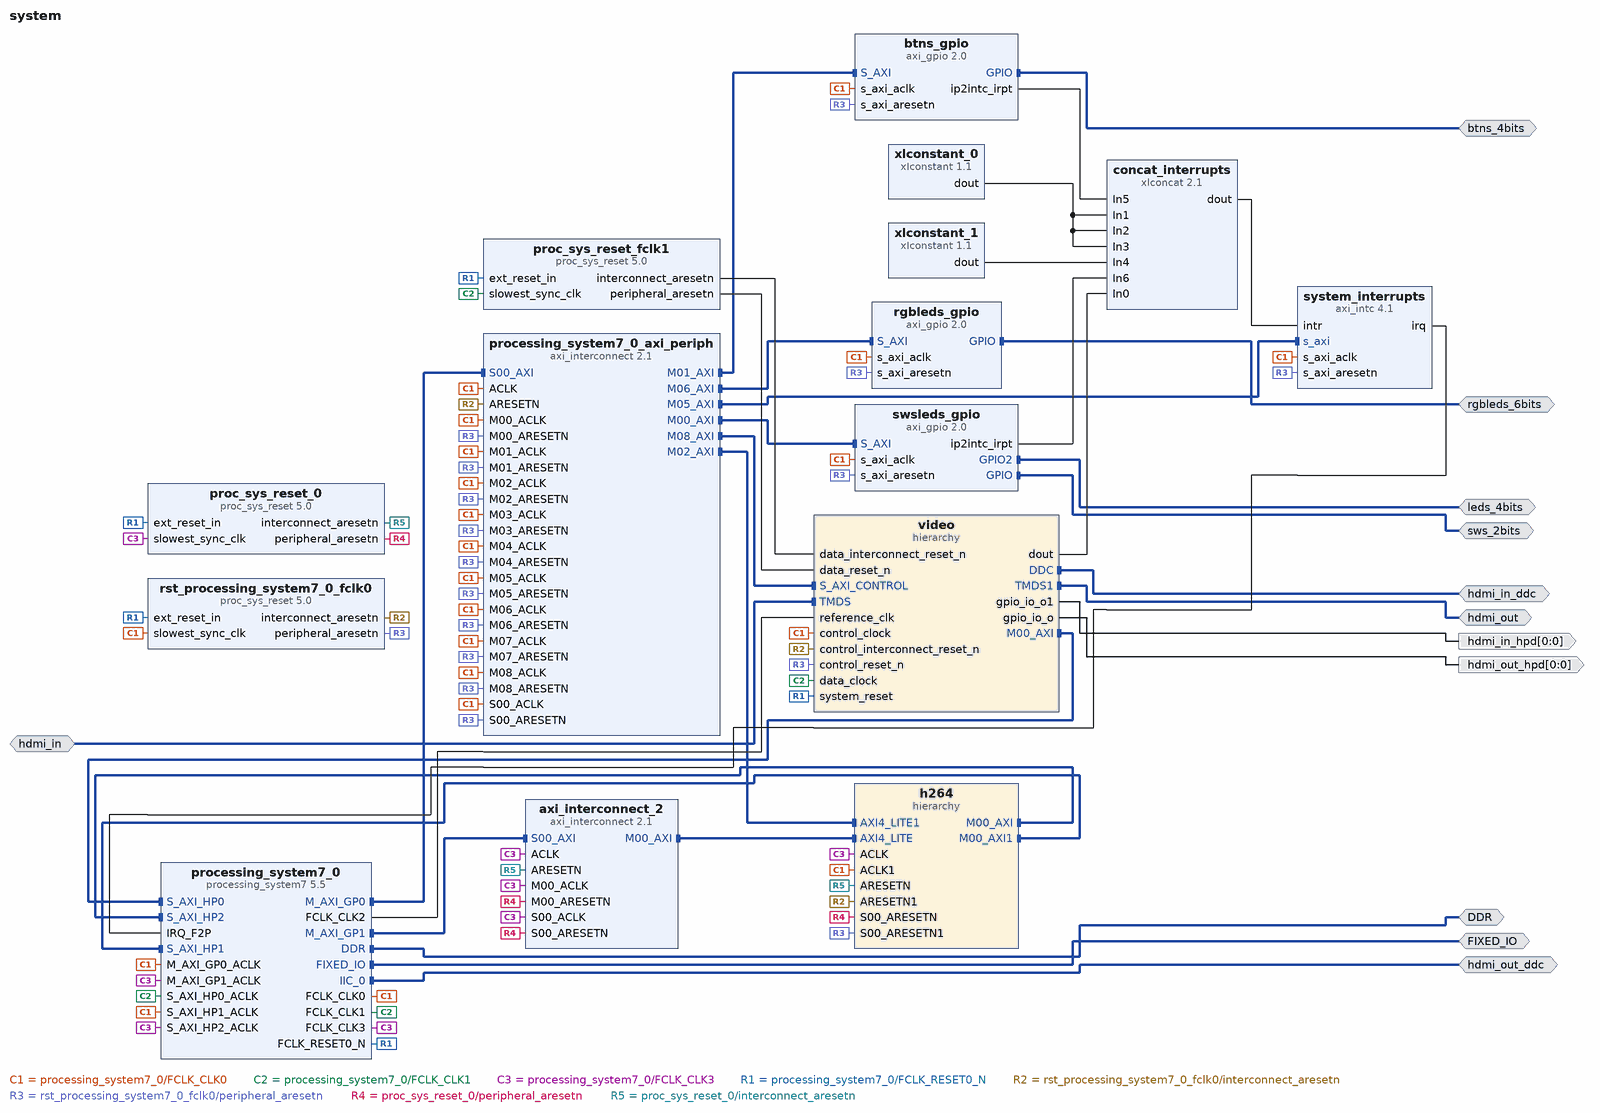
[diagram p0: block diagram of the top level]
# Vivado block design system, Vivado 2016.1
create_bd_design system

create_bd_intf_port -mode Master -vlnv xilinx.com:interface:ddrx_rtl:1.0 DDR
create_bd_intf_port -mode Master -vlnv xilinx.com:display_processing_system7:fixedio_rtl:1.0 FIXED_IO
create_bd_intf_port -mode Master -vlnv xilinx.com:interface:gpio_rtl:1.0 btns_4bits
create_bd_intf_port -mode Slave -vlnv digilentinc.com:interface:tmds_rtl:1.0 hdmi_in
create_bd_intf_port -mode Master -vlnv xilinx.com:interface:iic_rtl:1.0 hdmi_in_ddc
create_bd_intf_port -mode Master -vlnv digilentinc.com:interface:tmds_rtl:1.0 hdmi_out
create_bd_intf_port -mode Master -vlnv xilinx.com:interface:iic_rtl:1.0 hdmi_out_ddc
create_bd_intf_port -mode Master -vlnv xilinx.com:interface:gpio_rtl:1.0 leds_4bits
create_bd_intf_port -mode Master -vlnv xilinx.com:interface:gpio_rtl:1.0 rgbleds_6bits
create_bd_intf_port -mode Master -vlnv xilinx.com:interface:gpio_rtl:1.0 sws_2bits
create_bd_port -dir O -from 0 -to 0 hdmi_in_hpd
create_bd_port -dir O -from 0 -to 0 hdmi_out_hpd

create_bd_cell -type ip -vlnv xilinx.com:ip:axi_gpio:2.0 btns_gpio
set_property -dict {CONFIG.C_GPIO_WIDTH 4 CONFIG.C_ALL_INPUTS 1 CONFIG.C_INTERRUPT_PRESENT 1} [get_bd_cells btns_gpio]
create_bd_cell -type ip -vlnv xilinx.com:ip:xlconcat:2.1 concat_interrupts
set_property -dict {CONFIG.NUM_PORTS 7 CONFIG.IN4_WIDTH 3} [get_bd_cells concat_interrupts]
create_bd_cell -type ip -vlnv xilinx.com:ip:proc_sys_reset:5.0 proc_sys_reset_0
create_bd_cell -type ip -vlnv xilinx.com:ip:proc_sys_reset:5.0 proc_sys_reset_fclk1
create_bd_cell -type ip -vlnv xilinx.com:ip:processing_system7:5.5 processing_system7_0
set_property -dict [list \
  CONFIG.PCW_FCLK_CLK0_BUF true \
  CONFIG.PCW_FCLK_CLK1_BUF true \
  CONFIG.PCW_FCLK_CLK2_BUF true \
  CONFIG.PCW_FCLK_CLK3_BUF true \
  CONFIG.PCW_UIPARAM_DDR_FREQ_MHZ 525 \
  CONFIG.PCW_CRYSTAL_PERIPHERAL_FREQMHZ 50 \
  CONFIG.PCW_APU_PERIPHERAL_FREQMHZ 650 \
  CONFIG.PCW_SDIO_PERIPHERAL_FREQMHZ 50 \
  CONFIG.PCW_UART_PERIPHERAL_FREQMHZ 100 \
  CONFIG.PCW_I2C_PERIPHERAL_FREQMHZ 108.333336 \
  CONFIG.PCW_FPGA0_PERIPHERAL_FREQMHZ 100 \
  CONFIG.PCW_FPGA1_PERIPHERAL_FREQMHZ 142 \
  CONFIG.PCW_FPGA2_PERIPHERAL_FREQMHZ 200 \
  CONFIG.PCW_FPGA3_PERIPHERAL_FREQMHZ 30 \
  CONFIG.PCW_USE_M_AXI_GP1 1 \
  CONFIG.PCW_USE_S_AXI_HP0 1 \
  CONFIG.PCW_USE_S_AXI_HP1 1 \
  CONFIG.PCW_USE_S_AXI_HP2 1 \
  CONFIG.PCW_M_AXI_GP0_FREQMHZ 10 \
  CONFIG.PCW_S_AXI_HP0_FREQMHZ 10 \
  CONFIG.PCW_USE_FABRIC_INTERRUPT 1 \
  CONFIG.PCW_GPIO_EMIO_GPIO_WIDTH 7 \
  CONFIG.PCW_EN_CLK1_PORT 1 \
  CONFIG.PCW_EN_CLK2_PORT 1 \
  CONFIG.PCW_EN_CLK3_PORT 1 \
  CONFIG.PCW_IRQ_F2P_INTR 1 \
  CONFIG.PCW_PERIPHERAL_BOARD_PRESET None \
  CONFIG.PCW_PRESET_BANK1_VOLTAGE {LVCMOS 1.8V} \
  CONFIG.PCW_UIPARAM_DDR_BUS_WIDTH {16 Bit} \
  CONFIG.PCW_UIPARAM_DDR_PARTNO Custom \
  CONFIG.PCW_QSPI_PERIPHERAL_ENABLE 1 \
  CONFIG.PCW_QSPI_QSPI_IO {MIO 1 .. 6} \
  CONFIG.PCW_QSPI_GRP_SINGLE_SS_ENABLE 1 \
  CONFIG.PCW_QSPI_GRP_SINGLE_SS_IO {MIO 1 .. 6} \
  CONFIG.PCW_QSPI_GRP_FBCLK_ENABLE 1 \
  CONFIG.PCW_QSPI_GRP_FBCLK_IO {MIO 8} \
  CONFIG.PCW_ENET0_PERIPHERAL_ENABLE 1 \
  CONFIG.PCW_ENET0_ENET0_IO {MIO 16 .. 27} \
  CONFIG.PCW_ENET0_GRP_MDIO_ENABLE 1 \
  CONFIG.PCW_ENET0_GRP_MDIO_IO {MIO 52 .. 53} \
  CONFIG.PCW_SD0_PERIPHERAL_ENABLE 1 \
  CONFIG.PCW_SD0_SD0_IO {MIO 40 .. 45} \
  CONFIG.PCW_SD0_GRP_CD_ENABLE 1 \
  CONFIG.PCW_SD0_GRP_CD_IO {MIO 47} \
  CONFIG.PCW_SD0_GRP_WP_ENABLE 0 \
  CONFIG.PCW_UART0_PERIPHERAL_ENABLE 1 \
  CONFIG.PCW_UART0_UART0_IO {MIO 14 .. 15} \
  CONFIG.PCW_UART1_PERIPHERAL_ENABLE 0 \
  CONFIG.PCW_USB0_PERIPHERAL_ENABLE 1 \
  CONFIG.PCW_USB0_USB0_IO {MIO 28 .. 39} \
  CONFIG.PCW_I2C0_PERIPHERAL_ENABLE 1 \
  CONFIG.PCW_I2C0_I2C0_IO EMIO \
  CONFIG.PCW_GPIO_MIO_GPIO_ENABLE 0 \
  CONFIG.PCW_GPIO_EMIO_GPIO_ENABLE 1 \
  CONFIG.PCW_GPIO_EMIO_GPIO_IO 7 \
  CONFIG.PCW_FPGA_FCLK1_ENABLE 1 \
  CONFIG.PCW_FPGA_FCLK2_ENABLE 1 \
  CONFIG.PCW_FPGA_FCLK3_ENABLE 1 \
] [get_bd_cells processing_system7_0]
# 481 more settings of processing_system7_0 are not shown: defaults, MIO pin electricals, DDR timing, and values the tool derives
create_bd_cell -type ip -vlnv xilinx.com:ip:axi_interconnect:2.1 processing_system7_0_axi_periph
set_property -dict {CONFIG.NUM_MI 9} [get_bd_cells processing_system7_0_axi_periph]
create_bd_cell -type ip -vlnv xilinx.com:ip:axi_gpio:2.0 rgbleds_gpio
set_property -dict {CONFIG.C_GPIO_WIDTH 6 CONFIG.C_ALL_OUTPUTS 1} [get_bd_cells rgbleds_gpio]
create_bd_cell -type ip -vlnv xilinx.com:ip:proc_sys_reset:5.0 rst_processing_system7_0_fclk0
create_bd_cell -type ip -vlnv xilinx.com:ip:axi_gpio:2.0 swsleds_gpio
set_property -dict [list \
  CONFIG.C_GPIO_WIDTH 2 \
  CONFIG.C_GPIO2_WIDTH 4 \
  CONFIG.C_IS_DUAL 1 \
  CONFIG.C_ALL_INPUTS 1 \
  CONFIG.C_INTERRUPT_PRESENT 1 \
  CONFIG.C_ALL_OUTPUTS_2 1 \
] [get_bd_cells swsleds_gpio]
create_bd_cell -type ip -vlnv xilinx.com:ip:axi_intc:4.1 system_interrupts
create_bd_cell -type hier video
create_bd_cell -type ip -vlnv xilinx.com:ip:xlconstant:1.1 xlconstant_0
set_property -dict {CONFIG.CONST_VAL 0} [get_bd_cells xlconstant_0]
create_bd_cell -type ip -vlnv xilinx.com:ip:xlconstant:1.1 xlconstant_1
set_property -dict {CONFIG.CONST_WIDTH 3 CONFIG.CONST_VAL 0} [get_bd_cells xlconstant_1]
create_bd_cell -type ip -vlnv xilinx.com:ip:axi_interconnect:2.1 axi_interconnect_2
set_property -dict {CONFIG.NUM_MI 1} [get_bd_cells axi_interconnect_2]
create_bd_cell -type hier h264

# ---- hierarchy /video ----
current_bd_instance /video
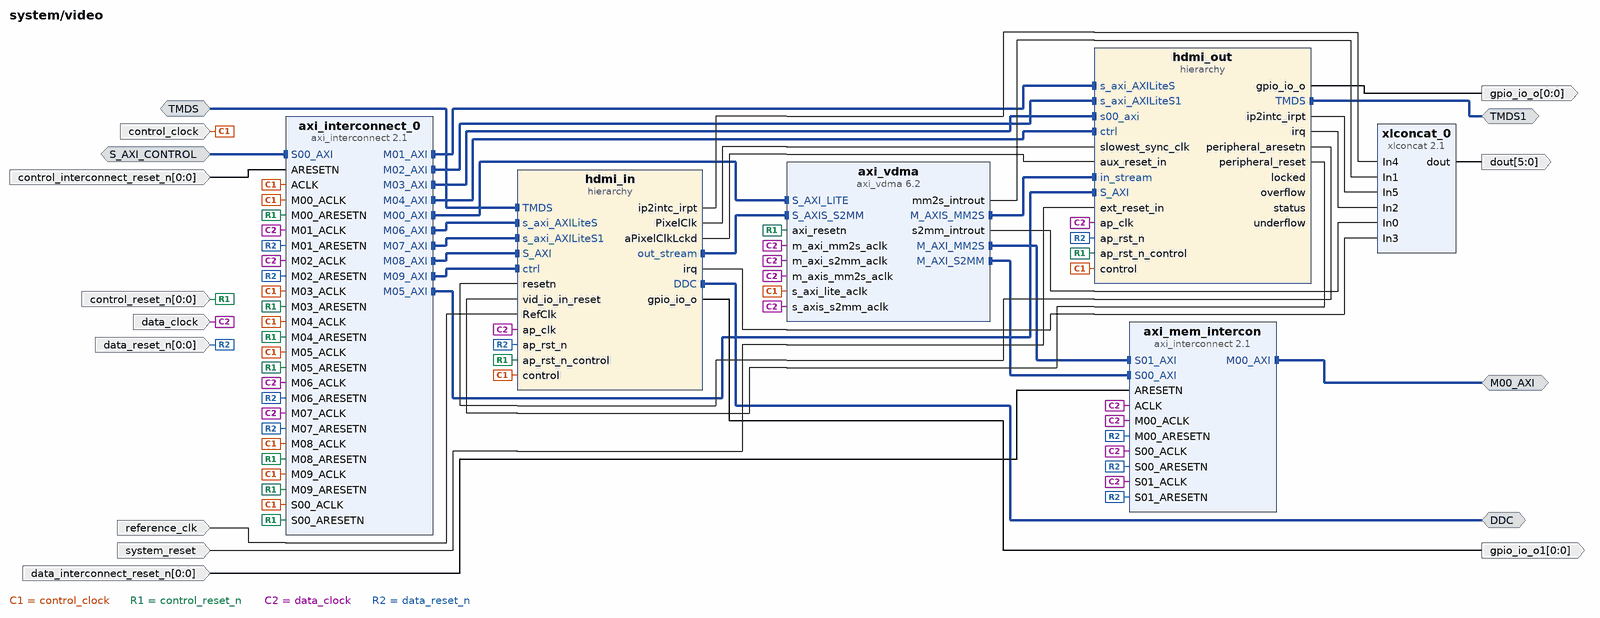
[diagram p1: block diagram inside /video]
create_bd_intf_pin -mode Master -vlnv xilinx.com:interface:iic_rtl:1.0 DDC
create_bd_intf_pin -mode Master -vlnv xilinx.com:interface:aximm_rtl:1.0 M00_AXI
create_bd_intf_pin -mode Slave -vlnv xilinx.com:interface:aximm_rtl:1.0 S_AXI_CONTROL
create_bd_intf_pin -mode Slave -vlnv digilentinc.com:interface:tmds_rtl:1.0 TMDS
create_bd_intf_pin -mode Master -vlnv digilentinc.com:interface:tmds_rtl:1.0 TMDS1
create_bd_pin -dir I -type clk control_clock
create_bd_pin -dir I -from 0 -to 0 -type rst control_interconnect_reset_n
create_bd_pin -dir I -from 0 -to 0 -type rst control_reset_n
create_bd_pin -dir I data_clock
create_bd_pin -dir I -from 0 -to 0 -type rst data_interconnect_reset_n
create_bd_pin -dir I -from 0 -to 0 -type rst data_reset_n
create_bd_pin -dir O -from 5 -to 0 dout
create_bd_pin -dir O -from 0 -to 0 gpio_io_o
create_bd_pin -dir O -from 0 -to 0 gpio_io_o1
create_bd_pin -dir I -type clk reference_clk
create_bd_pin -dir I -type rst system_reset

create_bd_cell -type ip -vlnv xilinx.com:ip:axi_interconnect:2.1 axi_interconnect_0
set_property -dict {CONFIG.NUM_MI 10} [get_bd_cells axi_interconnect_0]
create_bd_cell -type ip -vlnv xilinx.com:ip:axi_interconnect:2.1 axi_mem_intercon
set_property -dict {CONFIG.NUM_SI 2 CONFIG.NUM_MI 1} [get_bd_cells axi_mem_intercon]
create_bd_cell -type ip -vlnv xilinx.com:ip:axi_vdma:6.2 axi_vdma
set_property -dict [list \
  CONFIG.c_m_axi_mm2s_data_width 32 \
  CONFIG.c_m_axis_mm2s_tdata_width 32 \
  CONFIG.c_num_fstores 4 \
  CONFIG.c_mm2s_genlock_mode 1 \
  CONFIG.c_s2mm_genlock_mode 0 \
  CONFIG.c_mm2s_linebuffer_depth 512 \
  CONFIG.c_s2mm_linebuffer_depth 4096 \
  CONFIG.c_mm2s_max_burst_length 32 \
  CONFIG.c_s2mm_max_burst_length 32 \
] [get_bd_cells axi_vdma]
create_bd_cell -type hier hdmi_in
create_bd_cell -type hier hdmi_out
create_bd_cell -type ip -vlnv xilinx.com:ip:xlconcat:2.1 xlconcat_0
set_property -dict {CONFIG.NUM_PORTS 6} [get_bd_cells xlconcat_0]

# ---- hierarchy /video/hdmi_in ----
current_bd_instance /video/hdmi_in
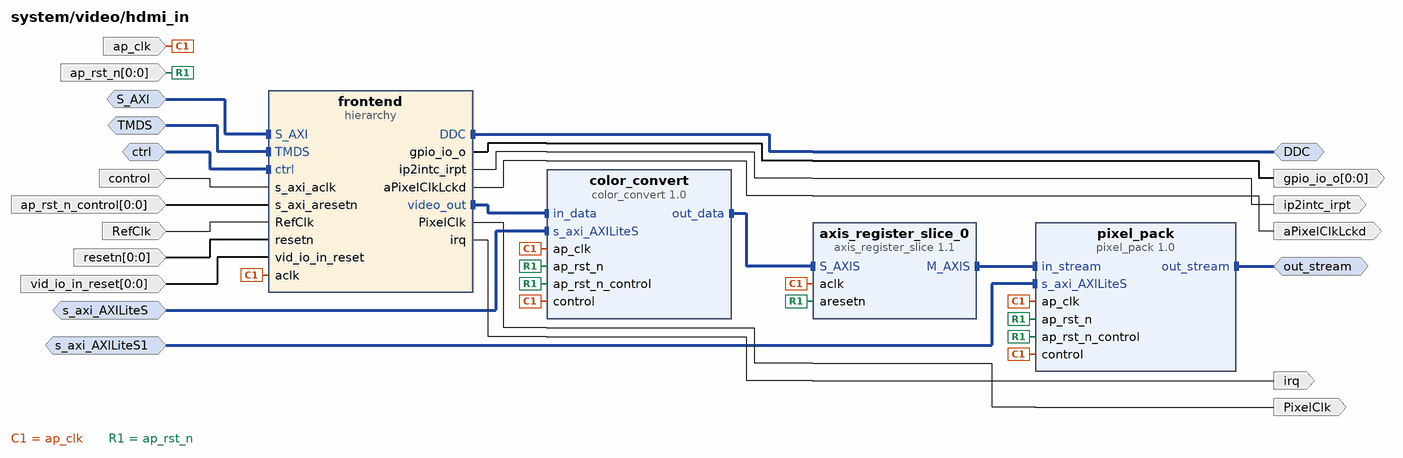
[diagram p2: block diagram inside /video/hdmi_in]
create_bd_intf_pin -mode Master -vlnv xilinx.com:interface:iic_rtl:1.0 DDC
create_bd_intf_pin -mode Slave -vlnv xilinx.com:interface:aximm_rtl:1.0 S_AXI
create_bd_intf_pin -mode Slave -vlnv digilentinc.com:interface:tmds_rtl:1.0 TMDS
create_bd_intf_pin -mode Slave -vlnv xilinx.com:interface:aximm_rtl:1.0 ctrl
create_bd_intf_pin -mode Master -vlnv xilinx.com:interface:axis_rtl:1.0 out_stream
create_bd_intf_pin -mode Slave -vlnv xilinx.com:interface:aximm_rtl:1.0 s_axi_AXILiteS
create_bd_intf_pin -mode Slave -vlnv xilinx.com:interface:aximm_rtl:1.0 s_axi_AXILiteS1
create_bd_pin -dir O -type clk PixelClk
create_bd_pin -dir I -type clk RefClk
create_bd_pin -dir O aPixelClkLckd
create_bd_pin -dir I -type clk ap_clk
create_bd_pin -dir I -from 0 -to 0 -type rst ap_rst_n
create_bd_pin -dir I -from 0 -to 0 -type rst ap_rst_n_control
create_bd_pin -dir I -type clk control
create_bd_pin -dir O -from 0 -to 0 gpio_io_o
create_bd_pin -dir O -type intr ip2intc_irpt
create_bd_pin -dir O -type intr irq
create_bd_pin -dir I -from 0 -to 0 -type rst resetn
create_bd_pin -dir I -from 0 -to 0 -type rst vid_io_in_reset

create_bd_cell -type ip -vlnv xilinx.com:ip:axis_register_slice:1.1 axis_register_slice_0
create_bd_cell -type ip -vlnv xilinx.com:hls:color_convert:1.0 color_convert
create_bd_cell -type hier frontend
create_bd_cell -type ip -vlnv xilinx.com:hls:pixel_pack:1.0 pixel_pack

# ---- hierarchy /video/hdmi_in/frontend ----
current_bd_instance /video/hdmi_in/frontend
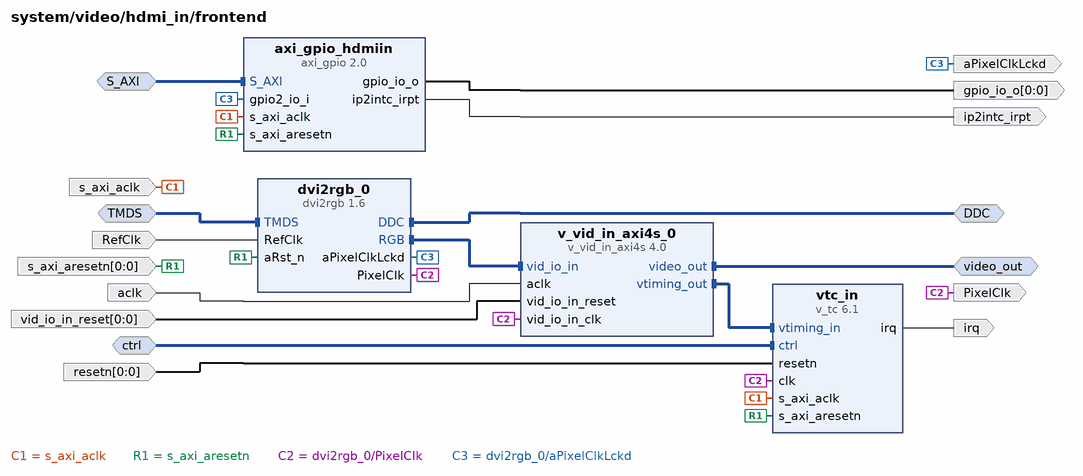
[diagram p3: block diagram inside /video/hdmi_in/frontend]
create_bd_intf_pin -mode Master -vlnv xilinx.com:interface:iic_rtl:1.0 DDC
create_bd_intf_pin -mode Slave -vlnv xilinx.com:interface:aximm_rtl:1.0 S_AXI
create_bd_intf_pin -mode Slave -vlnv digilentinc.com:interface:tmds_rtl:1.0 TMDS
create_bd_intf_pin -mode Slave -vlnv xilinx.com:interface:aximm_rtl:1.0 ctrl
create_bd_intf_pin -mode Master -vlnv xilinx.com:interface:axis_rtl:1.0 video_out
create_bd_pin -dir O -type clk PixelClk
create_bd_pin -dir I -type clk RefClk
create_bd_pin -dir O aPixelClkLckd
create_bd_pin -dir I -type clk aclk
create_bd_pin -dir O -from 0 -to 0 gpio_io_o
create_bd_pin -dir O -type intr ip2intc_irpt
create_bd_pin -dir O -type intr irq
create_bd_pin -dir I -from 0 -to 0 -type rst resetn
create_bd_pin -dir I -type clk s_axi_aclk
create_bd_pin -dir I -from 0 -to 0 -type rst s_axi_aresetn
create_bd_pin -dir I -from 0 -to 0 -type rst vid_io_in_reset

create_bd_cell -type ip -vlnv xilinx.com:ip:axi_gpio:2.0 axi_gpio_hdmiin
set_property -dict [list \
  CONFIG.C_GPIO_WIDTH 1 \
  CONFIG.C_GPIO2_WIDTH 1 \
  CONFIG.C_IS_DUAL 1 \
  CONFIG.C_ALL_INPUTS_2 1 \
  CONFIG.C_INTERRUPT_PRESENT 1 \
  CONFIG.C_ALL_OUTPUTS 1 \
] [get_bd_cells axi_gpio_hdmiin]
create_bd_cell -type ip -vlnv digilentinc.com:ip:dvi2rgb:1.6 dvi2rgb_0
set_property -dict [list \
  CONFIG.kRstActiveHigh false \
  CONFIG.kClkRange 1 \
  CONFIG.kAddBUFG false \
  CONFIG.kEdidFileName 720p_edid.txt \
] [get_bd_cells dvi2rgb_0]
create_bd_cell -type ip -vlnv xilinx.com:ip:v_vid_in_axi4s:4.0 v_vid_in_axi4s_0
set_property -dict {CONFIG.C_HAS_ASYNC_CLK 1 CONFIG.C_ADDR_WIDTH 12} [get_bd_cells v_vid_in_axi4s_0]
create_bd_cell -type ip -vlnv xilinx.com:ip:v_tc:6.1 vtc_in
set_property -dict [list \
  CONFIG.HAS_INTC_IF true \
  CONFIG.max_lines_per_frame 2048 \
  CONFIG.horizontal_blank_detection false \
  CONFIG.enable_generation false \
  CONFIG.vertical_blank_detection false \
] [get_bd_cells vtc_in]

# ---- hierarchy /video/hdmi_out ----
current_bd_instance /video/hdmi_out
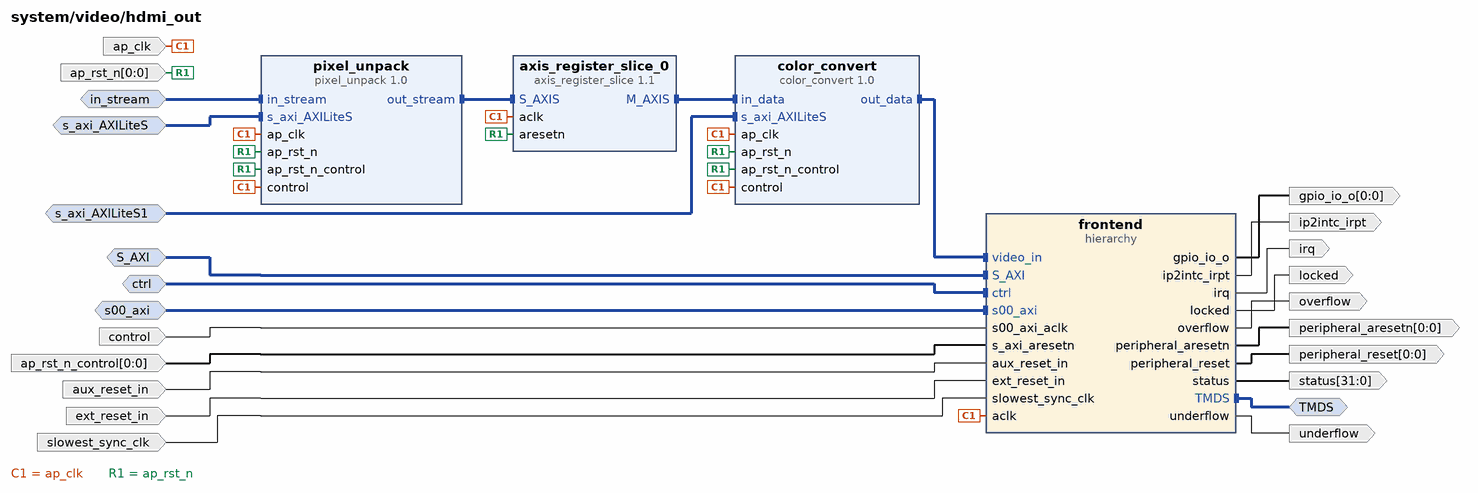
[diagram p4: block diagram inside /video/hdmi_out]
create_bd_intf_pin -mode Slave -vlnv xilinx.com:interface:aximm_rtl:1.0 S_AXI
create_bd_intf_pin -mode Master -vlnv digilentinc.com:interface:tmds_rtl:1.0 TMDS
create_bd_intf_pin -mode Slave -vlnv xilinx.com:interface:aximm_rtl:1.0 ctrl
create_bd_intf_pin -mode Slave -vlnv xilinx.com:interface:axis_rtl:1.0 in_stream
create_bd_intf_pin -mode Slave -vlnv xilinx.com:interface:aximm_rtl:1.0 s00_axi
create_bd_intf_pin -mode Slave -vlnv xilinx.com:interface:aximm_rtl:1.0 s_axi_AXILiteS
create_bd_intf_pin -mode Slave -vlnv xilinx.com:interface:aximm_rtl:1.0 s_axi_AXILiteS1
create_bd_pin -dir I -type clk ap_clk
create_bd_pin -dir I -from 0 -to 0 -type rst ap_rst_n
create_bd_pin -dir I -from 0 -to 0 -type rst ap_rst_n_control
create_bd_pin -dir I -type rst aux_reset_in
create_bd_pin -dir I -type clk control
create_bd_pin -dir I -type rst ext_reset_in
create_bd_pin -dir O -from 0 -to 0 gpio_io_o
create_bd_pin -dir O -type intr ip2intc_irpt
create_bd_pin -dir O -type intr irq
create_bd_pin -dir O locked
create_bd_pin -dir O overflow
create_bd_pin -dir O -from 0 -to 0 -type rst peripheral_aresetn
create_bd_pin -dir O -from 0 -to 0 -type rst peripheral_reset
create_bd_pin -dir I -type clk slowest_sync_clk
create_bd_pin -dir O -from 31 -to 0 status
create_bd_pin -dir O underflow

create_bd_cell -type ip -vlnv xilinx.com:ip:axis_register_slice:1.1 axis_register_slice_0
create_bd_cell -type ip -vlnv xilinx.com:hls:color_convert:1.0 color_convert
create_bd_cell -type hier frontend
create_bd_cell -type ip -vlnv xilinx.com:hls:pixel_unpack:1.0 pixel_unpack

# ---- hierarchy /video/hdmi_out/frontend ----
current_bd_instance /video/hdmi_out/frontend
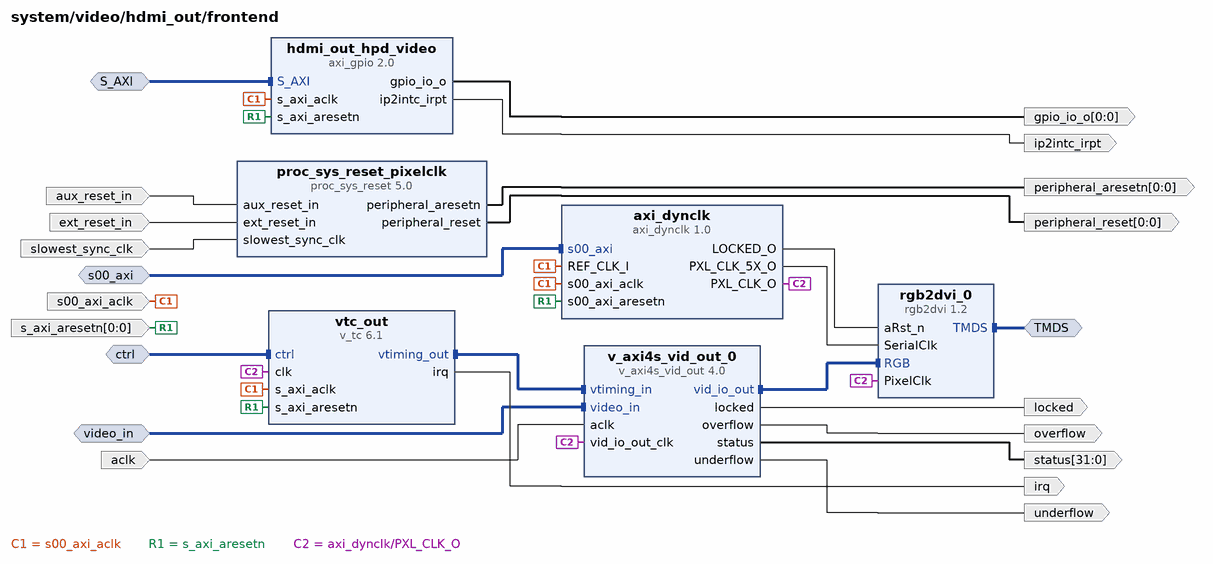
[diagram p5: block diagram inside /video/hdmi_out/frontend]
create_bd_intf_pin -mode Slave -vlnv xilinx.com:interface:aximm_rtl:1.0 S_AXI
create_bd_intf_pin -mode Master -vlnv digilentinc.com:interface:tmds_rtl:1.0 TMDS
create_bd_intf_pin -mode Slave -vlnv xilinx.com:interface:aximm_rtl:1.0 ctrl
create_bd_intf_pin -mode Slave -vlnv xilinx.com:interface:aximm_rtl:1.0 s00_axi
create_bd_intf_pin -mode Slave -vlnv xilinx.com:interface:axis_rtl:1.0 video_in
create_bd_pin -dir I -type clk aclk
create_bd_pin -dir I -type rst aux_reset_in
create_bd_pin -dir I -type rst ext_reset_in
create_bd_pin -dir O -from 0 -to 0 gpio_io_o
create_bd_pin -dir O -type intr ip2intc_irpt
create_bd_pin -dir O -type intr irq
create_bd_pin -dir O locked
create_bd_pin -dir O overflow
create_bd_pin -dir O -from 0 -to 0 -type rst peripheral_aresetn
create_bd_pin -dir O -from 0 -to 0 -type rst peripheral_reset
create_bd_pin -dir I -type clk s00_axi_aclk
create_bd_pin -dir I -from 0 -to 0 -type rst s_axi_aresetn
create_bd_pin -dir I -type clk slowest_sync_clk
create_bd_pin -dir O -from 31 -to 0 status
create_bd_pin -dir O underflow

create_bd_cell -type ip -vlnv digilentinc.com:ip:axi_dynclk:1.0 axi_dynclk
create_bd_cell -type ip -vlnv xilinx.com:ip:axi_gpio:2.0 hdmi_out_hpd_video
set_property -dict {CONFIG.C_GPIO_WIDTH 1 CONFIG.C_INTERRUPT_PRESENT 1 CONFIG.C_ALL_OUTPUTS 1} [get_bd_cells hdmi_out_hpd_video]
create_bd_cell -type ip -vlnv xilinx.com:ip:proc_sys_reset:5.0 proc_sys_reset_pixelclk
create_bd_cell -type ip -vlnv digilentinc.com:ip:rgb2dvi:1.2 rgb2dvi_0
set_property -dict {CONFIG.kRstActiveHigh false CONFIG.kGenerateSerialClk false CONFIG.kClkRange 2} [get_bd_cells rgb2dvi_0]
create_bd_cell -type ip -vlnv xilinx.com:ip:v_axi4s_vid_out:4.0 v_axi4s_vid_out_0
set_property -dict [list \
  CONFIG.C_HAS_ASYNC_CLK 1 \
  CONFIG.C_ADDR_WIDTH 11 \
  CONFIG.C_HYSTERESIS_LEVEL 1024 \
  CONFIG.C_VTG_MASTER_SLAVE 1 \
] [get_bd_cells v_axi4s_vid_out_0]
create_bd_cell -type ip -vlnv xilinx.com:ip:v_tc:6.1 vtc_out
set_property -dict {CONFIG.enable_detection false} [get_bd_cells vtc_out]

# ---- hierarchy /h264 ----
current_bd_instance /h264
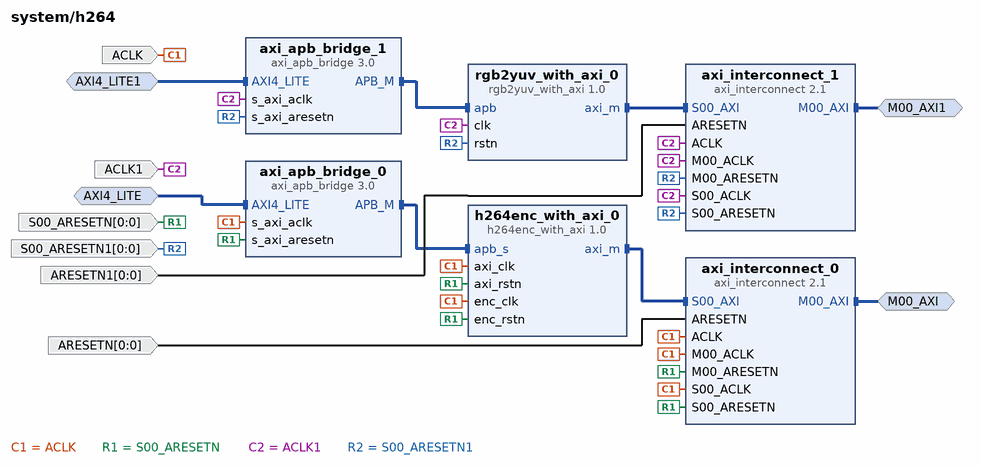
[diagram p6: block diagram inside /h264]
create_bd_intf_pin -mode Slave -vlnv xilinx.com:interface:aximm_rtl:1.0 AXI4_LITE
create_bd_intf_pin -mode Slave -vlnv xilinx.com:interface:aximm_rtl:1.0 AXI4_LITE1
create_bd_intf_pin -mode Master -vlnv xilinx.com:interface:aximm_rtl:1.0 M00_AXI
create_bd_intf_pin -mode Master -vlnv xilinx.com:interface:aximm_rtl:1.0 M00_AXI1
create_bd_pin -dir I -type clk ACLK
create_bd_pin -dir I -from 0 -to 0 -type rst S00_ARESETN
create_bd_pin -dir I -type clk ACLK1
create_bd_pin -dir I -from 0 -to 0 -type rst S00_ARESETN1
create_bd_pin -dir I -from 0 -to 0 -type rst ARESETN
create_bd_pin -dir I -from 0 -to 0 -type rst ARESETN1

create_bd_cell -type ip -vlnv xilinx.com:user:h264enc_with_axi:1.0 h264enc_with_axi_0
create_bd_cell -type ip -vlnv xilinx.com:user:rgb2yuv_with_axi:1.0 rgb2yuv_with_axi_0
create_bd_cell -type ip -vlnv xilinx.com:ip:axi_apb_bridge:3.0 axi_apb_bridge_0
set_property -dict {CONFIG.C_APB_NUM_SLAVES 1} [get_bd_cells axi_apb_bridge_0]
create_bd_cell -type ip -vlnv xilinx.com:ip:axi_apb_bridge:3.0 axi_apb_bridge_1
set_property -dict {CONFIG.C_APB_NUM_SLAVES 1} [get_bd_cells axi_apb_bridge_1]
create_bd_cell -type ip -vlnv xilinx.com:ip:axi_interconnect:2.1 axi_interconnect_0
set_property -dict {CONFIG.NUM_MI 1} [get_bd_cells axi_interconnect_0]
create_bd_cell -type ip -vlnv xilinx.com:ip:axi_interconnect:2.1 axi_interconnect_1
set_property -dict {CONFIG.NUM_MI 1} [get_bd_cells axi_interconnect_1]

# ---- connections ----

current_bd_instance /video
connect_bd_intf_net [get_bd_intf_pins axi_interconnect_0/M00_AXI] [get_bd_intf_pins axi_vdma/S_AXI_LITE]
connect_bd_intf_net [get_bd_intf_pins axi_interconnect_0/M01_AXI] [get_bd_intf_pins hdmi_out/s_axi_AXILiteS]
connect_bd_intf_net [get_bd_intf_pins axi_interconnect_0/M02_AXI] [get_bd_intf_pins hdmi_out/s_axi_AXILiteS1]
connect_bd_intf_net [get_bd_intf_pins axi_interconnect_0/M03_AXI] [get_bd_intf_pins hdmi_out/s00_axi]
connect_bd_intf_net [get_bd_intf_pins axi_interconnect_0/M04_AXI] [get_bd_intf_pins hdmi_out/ctrl]
connect_bd_intf_net [get_bd_intf_pins axi_interconnect_0/M05_AXI] [get_bd_intf_pins hdmi_out/S_AXI]
connect_bd_intf_net [get_bd_intf_pins axi_interconnect_0/M06_AXI] [get_bd_intf_pins hdmi_in/s_axi_AXILiteS]
connect_bd_intf_net [get_bd_intf_pins axi_interconnect_0/M07_AXI] [get_bd_intf_pins hdmi_in/s_axi_AXILiteS1]
connect_bd_intf_net [get_bd_intf_pins axi_interconnect_0/M08_AXI] [get_bd_intf_pins hdmi_in/S_AXI]
connect_bd_intf_net [get_bd_intf_pins axi_interconnect_0/M09_AXI] [get_bd_intf_pins hdmi_in/ctrl]
connect_bd_intf_net -intf_net axi_vdma_0_M_AXIS_MM2S [get_bd_intf_pins axi_vdma/M_AXIS_MM2S] [get_bd_intf_pins hdmi_out/in_stream]
connect_bd_intf_net -intf_net axi_vdma_0_M_AXI_MM2S [get_bd_intf_pins axi_mem_intercon/S01_AXI] [get_bd_intf_pins axi_vdma/M_AXI_MM2S]
connect_bd_intf_net -intf_net axi_vdma_0_M_AXI_S2MM [get_bd_intf_pins axi_mem_intercon/S00_AXI] [get_bd_intf_pins axi_vdma/M_AXI_S2MM]
connect_bd_intf_net -intf_net in_pixelformat_M00_AXIS [get_bd_intf_pins axi_vdma/S_AXIS_S2MM] [get_bd_intf_pins hdmi_in/out_stream]
connect_bd_intf_net -intf_net frontend_DDC [get_bd_intf_pins DDC] [get_bd_intf_pins hdmi_in/DDC]
connect_bd_intf_net [get_bd_intf_pins M00_AXI] [get_bd_intf_pins axi_mem_intercon/M00_AXI]
connect_bd_intf_net [get_bd_intf_pins S_AXI_CONTROL] [get_bd_intf_pins axi_interconnect_0/S00_AXI]
connect_bd_intf_net [get_bd_intf_pins TMDS] [get_bd_intf_pins hdmi_in/TMDS]
connect_bd_intf_net [get_bd_intf_pins TMDS1] [get_bd_intf_pins hdmi_out/TMDS]
connect_bd_net -net ARESETN_1 [get_bd_pins control_interconnect_reset_n] [get_bd_pins axi_interconnect_0/ARESETN]
connect_bd_net [get_bd_pins control_clock] \
  [get_bd_pins axi_vdma/s_axi_lite_aclk] [get_bd_pins axi_interconnect_0/ACLK] [get_bd_pins axi_interconnect_0/M00_ACLK] \
  [get_bd_pins axi_interconnect_0/M03_ACLK] [get_bd_pins axi_interconnect_0/M04_ACLK] \
  [get_bd_pins axi_interconnect_0/M05_ACLK] [get_bd_pins axi_interconnect_0/M08_ACLK] \
  [get_bd_pins axi_interconnect_0/M09_ACLK] [get_bd_pins axi_interconnect_0/S00_ACLK] [get_bd_pins hdmi_in/control] \
  [get_bd_pins hdmi_out/control]
connect_bd_net [get_bd_pins control_reset_n] \
  [get_bd_pins axi_vdma/axi_resetn] [get_bd_pins axi_interconnect_0/M00_ARESETN] [get_bd_pins axi_interconnect_0/M03_ARESETN] \
  [get_bd_pins axi_interconnect_0/M04_ARESETN] [get_bd_pins axi_interconnect_0/M05_ARESETN] \
  [get_bd_pins axi_interconnect_0/M08_ARESETN] [get_bd_pins axi_interconnect_0/M09_ARESETN] \
  [get_bd_pins axi_interconnect_0/S00_ARESETN] [get_bd_pins hdmi_in/ap_rst_n_control] [get_bd_pins hdmi_out/ap_rst_n_control]
connect_bd_net -net RefClk_1 [get_bd_pins reference_clk] [get_bd_pins hdmi_in/RefClk]
connect_bd_net -net aclk_1 [get_bd_pins data_clock] \
  [get_bd_pins axi_vdma/m_axi_mm2s_aclk] [get_bd_pins axi_vdma/m_axi_s2mm_aclk] [get_bd_pins axi_vdma/m_axis_mm2s_aclk] \
  [get_bd_pins axi_vdma/s_axis_s2mm_aclk] [get_bd_pins axi_interconnect_0/M01_ACLK] [get_bd_pins axi_interconnect_0/M02_ACLK] \
  [get_bd_pins axi_interconnect_0/M06_ACLK] [get_bd_pins axi_interconnect_0/M07_ACLK] [get_bd_pins axi_mem_intercon/ACLK] \
  [get_bd_pins axi_mem_intercon/M00_ACLK] [get_bd_pins axi_mem_intercon/S00_ACLK] [get_bd_pins axi_mem_intercon/S01_ACLK] \
  [get_bd_pins hdmi_in/ap_clk] [get_bd_pins hdmi_out/ap_clk]
connect_bd_net -net axi_gpio_video_gpio_io_o [get_bd_pins hdmi_in/gpio_io_o] [get_bd_pins gpio_io_o1]
connect_bd_net -net axi_gpio_video_ip2intc_irpt [get_bd_pins hdmi_in/ip2intc_irpt] [get_bd_pins xlconcat_0/In4]
connect_bd_net -net axi_vdma_0_mm2s_introut [get_bd_pins axi_vdma/mm2s_introut] [get_bd_pins xlconcat_0/In1]
connect_bd_net -net axi_vdma_0_s2mm_introut [get_bd_pins axi_vdma/s2mm_introut] [get_bd_pins xlconcat_0/In0]
connect_bd_net -net ext_reset_in_1 [get_bd_pins system_reset] [get_bd_pins hdmi_out/ext_reset_in]
connect_bd_net [get_bd_pins hdmi_in/PixelClk] [get_bd_pins hdmi_out/slowest_sync_clk]
connect_bd_net [get_bd_pins hdmi_in/aPixelClkLckd] [get_bd_pins hdmi_out/aux_reset_in]
connect_bd_net -net hdmi_out_hpd_video_gpio_io_o [get_bd_pins hdmi_out/gpio_io_o] [get_bd_pins gpio_io_o]
connect_bd_net -net hdmi_out_hpd_video_ip2intc_irpt [get_bd_pins hdmi_out/ip2intc_irpt] [get_bd_pins xlconcat_0/In5]
# net locked has one end: hdmi_out/locked
# net overflow has one end: hdmi_out/overflow
connect_bd_net -net resetn_1 [get_bd_pins hdmi_out/peripheral_aresetn] [get_bd_pins hdmi_in/resetn]
connect_bd_net -net rst_processing_system7_0_100M_interconnect_aresetn [get_bd_pins data_interconnect_reset_n] [get_bd_pins axi_mem_intercon/ARESETN]
connect_bd_net -net rst_processing_system7_0_100M_peripheral_aresetn [get_bd_pins data_reset_n] \
  [get_bd_pins axi_interconnect_0/M01_ARESETN] [get_bd_pins axi_interconnect_0/M02_ARESETN] \
  [get_bd_pins axi_interconnect_0/M06_ARESETN] [get_bd_pins axi_interconnect_0/M07_ARESETN] \
  [get_bd_pins axi_mem_intercon/M00_ARESETN] [get_bd_pins axi_mem_intercon/S00_ARESETN] \
  [get_bd_pins axi_mem_intercon/S01_ARESETN] [get_bd_pins hdmi_in/ap_rst_n] [get_bd_pins hdmi_out/ap_rst_n]
# net status has one end: hdmi_out/status
# net underflow has one end: hdmi_out/underflow
connect_bd_net -net v_tc_0_irq [get_bd_pins hdmi_out/irq] [get_bd_pins xlconcat_0/In2]
connect_bd_net -net v_tc_1_irq [get_bd_pins hdmi_in/irq] [get_bd_pins xlconcat_0/In3]
connect_bd_net -net vid_io_in_reset_1 [get_bd_pins hdmi_out/peripheral_reset] [get_bd_pins hdmi_in/vid_io_in_reset]
connect_bd_net [get_bd_pins xlconcat_0/dout] [get_bd_pins dout]

current_bd_instance /video/hdmi_in
connect_bd_intf_net [get_bd_intf_pins axis_register_slice_0/M_AXIS] [get_bd_intf_pins pixel_pack/in_stream]
connect_bd_intf_net [get_bd_intf_pins axis_register_slice_0/S_AXIS] [get_bd_intf_pins color_convert/out_data]
connect_bd_intf_net -intf_net hdmi_in_video_out [get_bd_intf_pins color_convert/in_data] [get_bd_intf_pins frontend/video_out]
connect_bd_intf_net [get_bd_intf_pins DDC] [get_bd_intf_pins frontend/DDC]
connect_bd_intf_net [get_bd_intf_pins S_AXI] [get_bd_intf_pins frontend/S_AXI]
connect_bd_intf_net [get_bd_intf_pins TMDS] [get_bd_intf_pins frontend/TMDS]
connect_bd_intf_net [get_bd_intf_pins ctrl] [get_bd_intf_pins frontend/ctrl]
connect_bd_intf_net -intf_net in_pixelformat_M00_AXIS [get_bd_intf_pins out_stream] [get_bd_intf_pins pixel_pack/out_stream]
connect_bd_intf_net [get_bd_intf_pins s_axi_AXILiteS] [get_bd_intf_pins color_convert/s_axi_AXILiteS]
connect_bd_intf_net [get_bd_intf_pins s_axi_AXILiteS1] [get_bd_intf_pins pixel_pack/s_axi_AXILiteS]
connect_bd_net [get_bd_pins control] [get_bd_pins frontend/s_axi_aclk]
connect_bd_net [get_bd_pins ap_rst_n_control] [get_bd_pins frontend/s_axi_aresetn]
connect_bd_net [get_bd_pins RefClk] [get_bd_pins frontend/RefClk]
connect_bd_net -net aclk_1 [get_bd_pins ap_clk] \
  [get_bd_pins axis_register_slice_0/aclk] [get_bd_pins color_convert/ap_clk] [get_bd_pins color_convert/control] \
  [get_bd_pins pixel_pack/ap_clk] [get_bd_pins pixel_pack/control] [get_bd_pins frontend/aclk]
connect_bd_net -net axi_gpio_video_gpio_io_o [get_bd_pins frontend/gpio_io_o] [get_bd_pins gpio_io_o]
connect_bd_net -net axi_gpio_video_ip2intc_irpt [get_bd_pins frontend/ip2intc_irpt] [get_bd_pins ip2intc_irpt]
connect_bd_net -net dvi2rgb_0_PixelClk [get_bd_pins frontend/PixelClk] [get_bd_pins PixelClk]
connect_bd_net -net dvi2rgb_0_aPixelClkLckd [get_bd_pins frontend/aPixelClkLckd] [get_bd_pins aPixelClkLckd]
connect_bd_net [get_bd_pins resetn] [get_bd_pins frontend/resetn]
connect_bd_net -net rst_processing_system7_0_100M_peripheral_aresetn [get_bd_pins ap_rst_n] \
  [get_bd_pins axis_register_slice_0/aresetn] [get_bd_pins color_convert/ap_rst_n] \
  [get_bd_pins color_convert/ap_rst_n_control] [get_bd_pins pixel_pack/ap_rst_n] [get_bd_pins pixel_pack/ap_rst_n_control]
connect_bd_net -net v_tc_1_irq [get_bd_pins frontend/irq] [get_bd_pins irq]
connect_bd_net [get_bd_pins vid_io_in_reset] [get_bd_pins frontend/vid_io_in_reset]

current_bd_instance /video/hdmi_in/frontend
connect_bd_intf_net [get_bd_intf_pins dvi2rgb_0/RGB] [get_bd_intf_pins v_vid_in_axi4s_0/vid_io_in]
connect_bd_intf_net [get_bd_intf_pins v_vid_in_axi4s_0/vtiming_out] [get_bd_intf_pins vtc_in/vtiming_in]
connect_bd_intf_net [get_bd_intf_pins DDC] [get_bd_intf_pins dvi2rgb_0/DDC]
connect_bd_intf_net [get_bd_intf_pins S_AXI] [get_bd_intf_pins axi_gpio_hdmiin/S_AXI]
connect_bd_intf_net [get_bd_intf_pins TMDS] [get_bd_intf_pins dvi2rgb_0/TMDS]
connect_bd_intf_net [get_bd_intf_pins ctrl] [get_bd_intf_pins vtc_in/ctrl]
connect_bd_intf_net -intf_net hdmi_in_video_out [get_bd_intf_pins video_out] [get_bd_intf_pins v_vid_in_axi4s_0/video_out]
connect_bd_net [get_bd_pins s_axi_aclk] [get_bd_pins axi_gpio_hdmiin/s_axi_aclk] [get_bd_pins vtc_in/s_axi_aclk]
connect_bd_net [get_bd_pins s_axi_aresetn] \
  [get_bd_pins axi_gpio_hdmiin/s_axi_aresetn] [get_bd_pins dvi2rgb_0/aRst_n] [get_bd_pins vtc_in/s_axi_aresetn]
connect_bd_net [get_bd_pins RefClk] [get_bd_pins dvi2rgb_0/RefClk]
connect_bd_net [get_bd_pins aclk] [get_bd_pins v_vid_in_axi4s_0/aclk]
connect_bd_net -net axi_gpio_video_gpio_io_o [get_bd_pins axi_gpio_hdmiin/gpio_io_o] [get_bd_pins gpio_io_o]
connect_bd_net -net axi_gpio_video_ip2intc_irpt [get_bd_pins axi_gpio_hdmiin/ip2intc_irpt] [get_bd_pins ip2intc_irpt]
connect_bd_net [get_bd_pins dvi2rgb_0/PixelClk] [get_bd_pins PixelClk] [get_bd_pins v_vid_in_axi4s_0/vid_io_in_clk] [get_bd_pins vtc_in/clk]
connect_bd_net [get_bd_pins dvi2rgb_0/aPixelClkLckd] [get_bd_pins aPixelClkLckd] [get_bd_pins axi_gpio_hdmiin/gpio2_io_i]
connect_bd_net [get_bd_pins resetn] [get_bd_pins vtc_in/resetn]
connect_bd_net -net v_tc_1_irq [get_bd_pins vtc_in/irq] [get_bd_pins irq]
connect_bd_net [get_bd_pins vid_io_in_reset] [get_bd_pins v_vid_in_axi4s_0/vid_io_in_reset]

current_bd_instance /video/hdmi_out
connect_bd_intf_net [get_bd_intf_pins axis_register_slice_0/M_AXIS] [get_bd_intf_pins color_convert/in_data]
connect_bd_intf_net [get_bd_intf_pins axis_register_slice_0/S_AXIS] [get_bd_intf_pins pixel_unpack/out_stream]
connect_bd_intf_net [get_bd_intf_pins color_convert/out_data] [get_bd_intf_pins frontend/video_in]
connect_bd_intf_net [get_bd_intf_pins S_AXI] [get_bd_intf_pins frontend/S_AXI]
connect_bd_intf_net [get_bd_intf_pins TMDS] [get_bd_intf_pins frontend/TMDS]
connect_bd_intf_net [get_bd_intf_pins ctrl] [get_bd_intf_pins frontend/ctrl]
connect_bd_intf_net -intf_net axi_vdma_0_M_AXIS_MM2S [get_bd_intf_pins in_stream] [get_bd_intf_pins pixel_unpack/in_stream]
connect_bd_intf_net [get_bd_intf_pins s00_axi] [get_bd_intf_pins frontend/s00_axi]
connect_bd_intf_net [get_bd_intf_pins s_axi_AXILiteS] [get_bd_intf_pins pixel_unpack/s_axi_AXILiteS]
connect_bd_intf_net [get_bd_intf_pins s_axi_AXILiteS1] [get_bd_intf_pins color_convert/s_axi_AXILiteS]
connect_bd_net [get_bd_pins control] [get_bd_pins frontend/s00_axi_aclk]
connect_bd_net [get_bd_pins ap_rst_n_control] [get_bd_pins frontend/s_axi_aresetn]
connect_bd_net -net aclk_1 [get_bd_pins ap_clk] \
  [get_bd_pins axis_register_slice_0/aclk] [get_bd_pins color_convert/ap_clk] [get_bd_pins color_convert/control] \
  [get_bd_pins pixel_unpack/ap_clk] [get_bd_pins pixel_unpack/control] [get_bd_pins frontend/aclk]
connect_bd_net [get_bd_pins aux_reset_in] [get_bd_pins frontend/aux_reset_in]
connect_bd_net [get_bd_pins ext_reset_in] [get_bd_pins frontend/ext_reset_in]
connect_bd_net [get_bd_pins frontend/peripheral_aresetn] [get_bd_pins peripheral_aresetn]
connect_bd_net [get_bd_pins frontend/peripheral_reset] [get_bd_pins peripheral_reset]
connect_bd_net -net hdmi_out_hpd_video_gpio_io_o [get_bd_pins frontend/gpio_io_o] [get_bd_pins gpio_io_o]
connect_bd_net -net hdmi_out_hpd_video_ip2intc_irpt [get_bd_pins frontend/ip2intc_irpt] [get_bd_pins ip2intc_irpt]
connect_bd_net -net locked [get_bd_pins frontend/locked] [get_bd_pins locked]
connect_bd_net -net overflow [get_bd_pins frontend/overflow] [get_bd_pins overflow]
connect_bd_net -net rst_processing_system7_0_100M_peripheral_aresetn [get_bd_pins ap_rst_n] \
  [get_bd_pins axis_register_slice_0/aresetn] [get_bd_pins color_convert/ap_rst_n] \
  [get_bd_pins color_convert/ap_rst_n_control] [get_bd_pins pixel_unpack/ap_rst_n] \
  [get_bd_pins pixel_unpack/ap_rst_n_control]
connect_bd_net [get_bd_pins slowest_sync_clk] [get_bd_pins frontend/slowest_sync_clk]
connect_bd_net -net status [get_bd_pins frontend/status] [get_bd_pins status]
connect_bd_net -net underflow [get_bd_pins frontend/underflow] [get_bd_pins underflow]
connect_bd_net -net v_tc_0_irq [get_bd_pins frontend/irq] [get_bd_pins irq]

current_bd_instance /video/hdmi_out/frontend
connect_bd_intf_net [get_bd_intf_pins rgb2dvi_0/RGB] [get_bd_intf_pins v_axi4s_vid_out_0/vid_io_out]
connect_bd_intf_net -intf_net v_tc_0_vtiming_out [get_bd_intf_pins v_axi4s_vid_out_0/vtiming_in] [get_bd_intf_pins vtc_out/vtiming_out]
connect_bd_intf_net [get_bd_intf_pins S_AXI] [get_bd_intf_pins hdmi_out_hpd_video/S_AXI]
connect_bd_intf_net [get_bd_intf_pins TMDS] [get_bd_intf_pins rgb2dvi_0/TMDS]
connect_bd_intf_net [get_bd_intf_pins ctrl] [get_bd_intf_pins vtc_out/ctrl]
connect_bd_intf_net [get_bd_intf_pins s00_axi] [get_bd_intf_pins axi_dynclk/s00_axi]
connect_bd_intf_net [get_bd_intf_pins video_in] [get_bd_intf_pins v_axi4s_vid_out_0/video_in]
connect_bd_net [get_bd_pins s00_axi_aclk] \
  [get_bd_pins axi_dynclk/REF_CLK_I] [get_bd_pins axi_dynclk/s00_axi_aclk] [get_bd_pins hdmi_out_hpd_video/s_axi_aclk] \
  [get_bd_pins vtc_out/s_axi_aclk]
connect_bd_net [get_bd_pins s_axi_aresetn] \
  [get_bd_pins axi_dynclk/s00_axi_aresetn] [get_bd_pins hdmi_out_hpd_video/s_axi_aresetn] [get_bd_pins vtc_out/s_axi_aresetn]
connect_bd_net [get_bd_pins aclk] [get_bd_pins v_axi4s_vid_out_0/aclk]
connect_bd_net [get_bd_pins aux_reset_in] [get_bd_pins proc_sys_reset_pixelclk/aux_reset_in]
connect_bd_net -net axi_dynclk_0_LOCKED_O [get_bd_pins axi_dynclk/LOCKED_O] [get_bd_pins rgb2dvi_0/aRst_n]
connect_bd_net -net axi_dynclk_0_PXL_CLK_5X_O [get_bd_pins axi_dynclk/PXL_CLK_5X_O] [get_bd_pins rgb2dvi_0/SerialClk]
connect_bd_net -net axi_dynclk_0_PXL_CLK_O [get_bd_pins axi_dynclk/PXL_CLK_O] \
  [get_bd_pins rgb2dvi_0/PixelClk] [get_bd_pins v_axi4s_vid_out_0/vid_io_out_clk] [get_bd_pins vtc_out/clk]
connect_bd_net [get_bd_pins ext_reset_in] [get_bd_pins proc_sys_reset_pixelclk/ext_reset_in]
connect_bd_net [get_bd_pins hdmi_out_hpd_video/gpio_io_o] [get_bd_pins gpio_io_o]
connect_bd_net [get_bd_pins hdmi_out_hpd_video/ip2intc_irpt] [get_bd_pins ip2intc_irpt]
connect_bd_net -net locked [get_bd_pins v_axi4s_vid_out_0/locked] [get_bd_pins locked]
connect_bd_net -net overflow [get_bd_pins v_axi4s_vid_out_0/overflow] [get_bd_pins overflow]
connect_bd_net [get_bd_pins proc_sys_reset_pixelclk/peripheral_aresetn] [get_bd_pins peripheral_aresetn]
connect_bd_net [get_bd_pins proc_sys_reset_pixelclk/peripheral_reset] [get_bd_pins peripheral_reset]
connect_bd_net [get_bd_pins slowest_sync_clk] [get_bd_pins proc_sys_reset_pixelclk/slowest_sync_clk]
connect_bd_net -net status [get_bd_pins v_axi4s_vid_out_0/status] [get_bd_pins status]
connect_bd_net -net underflow [get_bd_pins v_axi4s_vid_out_0/underflow] [get_bd_pins underflow]
connect_bd_net -net v_tc_0_irq [get_bd_pins vtc_out/irq] [get_bd_pins irq]

current_bd_instance /h264
connect_bd_intf_net [get_bd_intf_pins h264enc_with_axi_0/axi_m] [get_bd_intf_pins axi_interconnect_0/S00_AXI]
connect_bd_intf_net [get_bd_intf_pins h264enc_with_axi_0/apb_s] [get_bd_intf_pins axi_apb_bridge_0/APB_M]
connect_bd_intf_net [get_bd_intf_pins axi_interconnect_1/S00_AXI] [get_bd_intf_pins rgb2yuv_with_axi_0/axi_m]
connect_bd_intf_net [get_bd_intf_pins rgb2yuv_with_axi_0/apb] [get_bd_intf_pins axi_apb_bridge_1/APB_M]
connect_bd_intf_net -intf_net axi_interconnect_2_M00_AXI [get_bd_intf_pins AXI4_LITE] [get_bd_intf_pins axi_apb_bridge_0/AXI4_LITE]
connect_bd_intf_net [get_bd_intf_pins AXI4_LITE1] [get_bd_intf_pins axi_apb_bridge_1/AXI4_LITE]
connect_bd_intf_net [get_bd_intf_pins M00_AXI] [get_bd_intf_pins axi_interconnect_0/M00_AXI]
connect_bd_intf_net [get_bd_intf_pins M00_AXI1] [get_bd_intf_pins axi_interconnect_1/M00_AXI]
connect_bd_net -net processing_system7_0_FCLK_CLK3 [get_bd_pins ACLK] \
  [get_bd_pins axi_interconnect_0/ACLK] [get_bd_pins axi_interconnect_0/S00_ACLK] [get_bd_pins axi_interconnect_0/M00_ACLK] \
  [get_bd_pins h264enc_with_axi_0/enc_clk] [get_bd_pins axi_apb_bridge_0/s_axi_aclk] [get_bd_pins h264enc_with_axi_0/axi_clk]
connect_bd_net -net proc_sys_reset_0_peripheral_aresetn [get_bd_pins S00_ARESETN] \
  [get_bd_pins axi_interconnect_0/S00_ARESETN] [get_bd_pins axi_interconnect_0/M00_ARESETN] \
  [get_bd_pins h264enc_with_axi_0/enc_rstn] [get_bd_pins axi_apb_bridge_0/s_axi_aresetn] \
  [get_bd_pins h264enc_with_axi_0/axi_rstn]
connect_bd_net -net processing_system7_0_FCLK_CLK0 [get_bd_pins ACLK1] \
  [get_bd_pins axi_interconnect_1/ACLK] [get_bd_pins axi_interconnect_1/S00_ACLK] [get_bd_pins axi_interconnect_1/M00_ACLK] \
  [get_bd_pins axi_apb_bridge_1/s_axi_aclk] [get_bd_pins rgb2yuv_with_axi_0/clk]
connect_bd_net -net rst_processing_system7_0_fclk0_peripheral_aresetn [get_bd_pins S00_ARESETN1] \
  [get_bd_pins axi_interconnect_1/S00_ARESETN] [get_bd_pins axi_interconnect_1/M00_ARESETN] \
  [get_bd_pins axi_apb_bridge_1/s_axi_aresetn] [get_bd_pins rgb2yuv_with_axi_0/rstn]
connect_bd_net [get_bd_pins ARESETN] [get_bd_pins axi_interconnect_0/ARESETN]
connect_bd_net -net rst_processing_system7_0_fclk0_interconnect_aresetn [get_bd_pins ARESETN1] [get_bd_pins axi_interconnect_1/ARESETN]

current_bd_instance /
connect_bd_intf_net -intf_net axi_mem_intercon_M00_AXI [get_bd_intf_pins processing_system7_0/S_AXI_HP0] [get_bd_intf_pins video/M00_AXI]
connect_bd_intf_net [get_bd_intf_pins processing_system7_0/M_AXI_GP0] [get_bd_intf_pins processing_system7_0_axi_periph/S00_AXI]
connect_bd_intf_net [get_bd_intf_pins processing_system7_0_axi_periph/M00_AXI] [get_bd_intf_pins swsleds_gpio/S_AXI]
connect_bd_intf_net [get_bd_intf_pins btns_gpio/S_AXI] [get_bd_intf_pins processing_system7_0_axi_periph/M01_AXI]
connect_bd_intf_net [get_bd_intf_pins processing_system7_0_axi_periph/M05_AXI] [get_bd_intf_pins system_interrupts/s_axi]
connect_bd_intf_net [get_bd_intf_pins processing_system7_0_axi_periph/M06_AXI] [get_bd_intf_pins rgbleds_gpio/S_AXI]
connect_bd_intf_net [get_bd_intf_pins processing_system7_0_axi_periph/M08_AXI] [get_bd_intf_pins video/S_AXI_CONTROL]
connect_bd_intf_net -intf_net axi_interconnect_0_M00_AXI [get_bd_intf_pins h264/M00_AXI] [get_bd_intf_pins processing_system7_0/S_AXI_HP2]
connect_bd_intf_net -intf_net axi_interconnect_1_M00_AXI [get_bd_intf_pins processing_system7_0/S_AXI_HP1] [get_bd_intf_pins h264/M00_AXI1]
connect_bd_intf_net [get_bd_intf_pins axi_interconnect_2/S00_AXI] [get_bd_intf_pins processing_system7_0/M_AXI_GP1]
connect_bd_intf_net [get_bd_intf_pins h264/AXI4_LITE] [get_bd_intf_pins axi_interconnect_2/M00_AXI]
connect_bd_intf_net [get_bd_intf_pins processing_system7_0_axi_periph/M02_AXI] [get_bd_intf_pins h264/AXI4_LITE1]
connect_bd_intf_net [get_bd_intf_ports DDR] [get_bd_intf_pins processing_system7_0/DDR]
connect_bd_intf_net [get_bd_intf_ports FIXED_IO] [get_bd_intf_pins processing_system7_0/FIXED_IO]
connect_bd_intf_net [get_bd_intf_ports btns_4bits] [get_bd_intf_pins btns_gpio/GPIO]
connect_bd_intf_net [get_bd_intf_ports hdmi_in] [get_bd_intf_pins video/TMDS]
connect_bd_intf_net -intf_net dvi2rgb_0_DDC [get_bd_intf_ports hdmi_in_ddc] [get_bd_intf_pins video/DDC]
connect_bd_intf_net [get_bd_intf_ports hdmi_out] [get_bd_intf_pins video/TMDS1]
connect_bd_intf_net [get_bd_intf_ports hdmi_out_ddc] [get_bd_intf_pins processing_system7_0/IIC_0]
connect_bd_intf_net [get_bd_intf_ports leds_4bits] [get_bd_intf_pins swsleds_gpio/GPIO2]
connect_bd_intf_net -intf_net rgbled_gpio_GPIO [get_bd_intf_ports rgbleds_6bits] [get_bd_intf_pins rgbleds_gpio/GPIO]
connect_bd_intf_net [get_bd_intf_ports sws_2bits] [get_bd_intf_pins swsleds_gpio/GPIO]
connect_bd_net -net axi_gpio_video_gpio_io_o [get_bd_pins video/gpio_io_o1] [get_bd_ports hdmi_in_hpd]
connect_bd_net [get_bd_pins btns_gpio/ip2intc_irpt] [get_bd_pins concat_interrupts/In5]
connect_bd_net [get_bd_pins concat_interrupts/dout] [get_bd_pins system_interrupts/intr]
connect_bd_net -net hdmi_out_hpd_video_gpio_io_o [get_bd_pins video/gpio_io_o] [get_bd_ports hdmi_out_hpd]
connect_bd_net -net iop_interrupts_irq [get_bd_pins system_interrupts/irq] [get_bd_pins processing_system7_0/IRQ_F2P]
connect_bd_net [get_bd_pins proc_sys_reset_fclk1/interconnect_aresetn] [get_bd_pins video/data_interconnect_reset_n]
connect_bd_net [get_bd_pins proc_sys_reset_fclk1/peripheral_aresetn] [get_bd_pins video/data_reset_n]
connect_bd_net [get_bd_pins processing_system7_0/FCLK_CLK0] \
  [get_bd_pins btns_gpio/s_axi_aclk] [get_bd_pins processing_system7_0/M_AXI_GP0_ACLK] [get_bd_pins rgbleds_gpio/s_axi_aclk] \
  [get_bd_pins rst_processing_system7_0_fclk0/slowest_sync_clk] [get_bd_pins swsleds_gpio/s_axi_aclk] \
  [get_bd_pins system_interrupts/s_axi_aclk] [get_bd_pins processing_system7_0_axi_periph/ACLK] \
  [get_bd_pins processing_system7_0_axi_periph/M00_ACLK] [get_bd_pins processing_system7_0_axi_periph/M01_ACLK] \
  [get_bd_pins processing_system7_0_axi_periph/M02_ACLK] [get_bd_pins processing_system7_0_axi_periph/M03_ACLK] \
  [get_bd_pins processing_system7_0_axi_periph/M04_ACLK] [get_bd_pins processing_system7_0_axi_periph/M05_ACLK] \
  [get_bd_pins processing_system7_0_axi_periph/M06_ACLK] [get_bd_pins processing_system7_0_axi_periph/M07_ACLK] \
  [get_bd_pins processing_system7_0_axi_periph/M08_ACLK] [get_bd_pins processing_system7_0_axi_periph/S00_ACLK] \
  [get_bd_pins video/control_clock] [get_bd_pins processing_system7_0/S_AXI_HP1_ACLK] [get_bd_pins h264/ACLK1]
connect_bd_net [get_bd_pins processing_system7_0/FCLK_CLK1] \
  [get_bd_pins proc_sys_reset_fclk1/slowest_sync_clk] [get_bd_pins processing_system7_0/S_AXI_HP0_ACLK] \
  [get_bd_pins video/data_clock]
connect_bd_net [get_bd_pins processing_system7_0/FCLK_CLK2] [get_bd_pins video/reference_clk]
connect_bd_net [get_bd_pins processing_system7_0/FCLK_CLK3] \
  [get_bd_pins proc_sys_reset_0/slowest_sync_clk] [get_bd_pins processing_system7_0/M_AXI_GP1_ACLK] \
  [get_bd_pins axi_interconnect_2/ACLK] [get_bd_pins axi_interconnect_2/S00_ACLK] [get_bd_pins axi_interconnect_2/M00_ACLK] \
  [get_bd_pins processing_system7_0/S_AXI_HP2_ACLK] [get_bd_pins h264/ACLK]
connect_bd_net [get_bd_pins processing_system7_0/FCLK_RESET0_N] \
  [get_bd_pins proc_sys_reset_fclk1/ext_reset_in] [get_bd_pins rst_processing_system7_0_fclk0/ext_reset_in] \
  [get_bd_pins proc_sys_reset_0/ext_reset_in] [get_bd_pins video/system_reset]
connect_bd_net [get_bd_pins rst_processing_system7_0_fclk0/interconnect_aresetn] \
  [get_bd_pins processing_system7_0_axi_periph/ARESETN] [get_bd_pins video/control_interconnect_reset_n] \
  [get_bd_pins h264/ARESETN1]
connect_bd_net [get_bd_pins rst_processing_system7_0_fclk0/peripheral_aresetn] \
  [get_bd_pins btns_gpio/s_axi_aresetn] [get_bd_pins rgbleds_gpio/s_axi_aresetn] [get_bd_pins swsleds_gpio/s_axi_aresetn] \
  [get_bd_pins system_interrupts/s_axi_aresetn] [get_bd_pins processing_system7_0_axi_periph/M00_ARESETN] \
  [get_bd_pins processing_system7_0_axi_periph/M01_ARESETN] [get_bd_pins processing_system7_0_axi_periph/M02_ARESETN] \
  [get_bd_pins processing_system7_0_axi_periph/M03_ARESETN] [get_bd_pins processing_system7_0_axi_periph/M04_ARESETN] \
  [get_bd_pins processing_system7_0_axi_periph/M05_ARESETN] [get_bd_pins processing_system7_0_axi_periph/M06_ARESETN] \
  [get_bd_pins processing_system7_0_axi_periph/M07_ARESETN] [get_bd_pins processing_system7_0_axi_periph/M08_ARESETN] \
  [get_bd_pins processing_system7_0_axi_periph/S00_ARESETN] [get_bd_pins video/control_reset_n] \
  [get_bd_pins h264/S00_ARESETN1]
connect_bd_net [get_bd_pins swsleds_gpio/ip2intc_irpt] [get_bd_pins concat_interrupts/In6]
connect_bd_net [get_bd_pins video/dout] [get_bd_pins concat_interrupts/In0]
connect_bd_net [get_bd_pins xlconstant_0/dout] \
  [get_bd_pins concat_interrupts/In1] [get_bd_pins concat_interrupts/In2] [get_bd_pins concat_interrupts/In3]
connect_bd_net [get_bd_pins xlconstant_1/dout] [get_bd_pins concat_interrupts/In4]
connect_bd_net [get_bd_pins proc_sys_reset_0/peripheral_aresetn] \
  [get_bd_pins axi_interconnect_2/S00_ARESETN] [get_bd_pins axi_interconnect_2/M00_ARESETN] [get_bd_pins h264/S00_ARESETN]
connect_bd_net -net ARESETN_1 [get_bd_pins proc_sys_reset_0/interconnect_aresetn] [get_bd_pins axi_interconnect_2/ARESETN] [get_bd_pins h264/ARESETN]

# ---- address map ----
assign_bd_address -offset 0x00000000 -range 512M -target_address_space [get_bd_addr_spaces h264/h264enc_with_axi_0/axi_m] [get_bd_addr_segs processing_system7_0/S_AXI_HP2/HP2_DDR_LOWOCM]
assign_bd_address -offset 0x00000000 -range 512M -target_address_space [get_bd_addr_spaces h264/rgb2yuv_with_axi_0/axi_m] [get_bd_addr_segs processing_system7_0/S_AXI_HP1/HP1_DDR_LOWOCM]
assign_bd_address -offset 0x41200000 -range 64K -target_address_space [get_bd_addr_spaces processing_system7_0/Data] [get_bd_addr_segs btns_gpio/S_AXI/Reg]
assign_bd_address -offset 0x41210000 -range 64K -target_address_space [get_bd_addr_spaces processing_system7_0/Data] [get_bd_addr_segs rgbleds_gpio/S_AXI/Reg]
assign_bd_address -offset 0x41220000 -range 64K -target_address_space [get_bd_addr_spaces processing_system7_0/Data] [get_bd_addr_segs swsleds_gpio/S_AXI/Reg]
assign_bd_address -offset 0x41230000 -range 64K -target_address_space [get_bd_addr_spaces processing_system7_0/Data] [get_bd_addr_segs video/hdmi_in/frontend/axi_gpio_hdmiin/S_AXI/Reg]
assign_bd_address -offset 0x41240000 -range 64K -target_address_space [get_bd_addr_spaces processing_system7_0/Data] [get_bd_addr_segs video/hdmi_out/frontend/hdmi_out_hpd_video/S_AXI/Reg]
assign_bd_address -offset 0x41800000 -range 64K -target_address_space [get_bd_addr_spaces processing_system7_0/Data] [get_bd_addr_segs system_interrupts/s_axi/Reg]
assign_bd_address -offset 0x43000000 -range 64K -target_address_space [get_bd_addr_spaces processing_system7_0/Data] [get_bd_addr_segs video/axi_vdma/S_AXI_LITE/Reg]
assign_bd_address -offset 0x43C00000 -range 64K -target_address_space [get_bd_addr_spaces processing_system7_0/Data] [get_bd_addr_segs h264/rgb2yuv_with_axi_0/apb_s/apb_s]
assign_bd_address -offset 0x43C10000 -range 64K -target_address_space [get_bd_addr_spaces processing_system7_0/Data] [get_bd_addr_segs video/hdmi_in/color_convert/s_axi_AXILiteS/Reg]
assign_bd_address -offset 0x43C20000 -range 64K -target_address_space [get_bd_addr_spaces processing_system7_0/Data] [get_bd_addr_segs video/hdmi_in/frontend/vtc_in/ctrl/Reg]
assign_bd_address -offset 0x43C30000 -range 64K -target_address_space [get_bd_addr_spaces processing_system7_0/Data] [get_bd_addr_segs video/hdmi_in/pixel_pack/s_axi_AXILiteS/Reg]
assign_bd_address -offset 0x43C40000 -range 64K -target_address_space [get_bd_addr_spaces processing_system7_0/Data] [get_bd_addr_segs video/hdmi_out/color_convert/s_axi_AXILiteS/Reg]
assign_bd_address -offset 0x43C50000 -range 64K -target_address_space [get_bd_addr_spaces processing_system7_0/Data] [get_bd_addr_segs video/hdmi_out/frontend/axi_dynclk/s00_axi/reg0]
assign_bd_address -offset 0x43C60000 -range 64K -target_address_space [get_bd_addr_spaces processing_system7_0/Data] [get_bd_addr_segs video/hdmi_out/frontend/vtc_out/ctrl/Reg]
assign_bd_address -offset 0x43C70000 -range 64K -target_address_space [get_bd_addr_spaces processing_system7_0/Data] [get_bd_addr_segs video/hdmi_out/pixel_unpack/s_axi_AXILiteS/Reg]
assign_bd_address -offset 0x83C00000 -range 64K -target_address_space [get_bd_addr_spaces processing_system7_0/Data] [get_bd_addr_segs h264/h264enc_with_axi_0/apb_s/apb_s]
assign_bd_address -offset 0x00000000 -range 512M -target_address_space [get_bd_addr_spaces video/axi_vdma/Data_MM2S] [get_bd_addr_segs processing_system7_0/S_AXI_HP0/HP0_DDR_LOWOCM]
assign_bd_address -offset 0x00000000 -range 512M -target_address_space [get_bd_addr_spaces video/axi_vdma/Data_S2MM] [get_bd_addr_segs processing_system7_0/S_AXI_HP0/HP0_DDR_LOWOCM]

validate_bd_design
save_bd_design
